# Altium schematic sheet Microcontroller.SchDoc
size A3; SheetNumber: 2; SheetTotal: 8
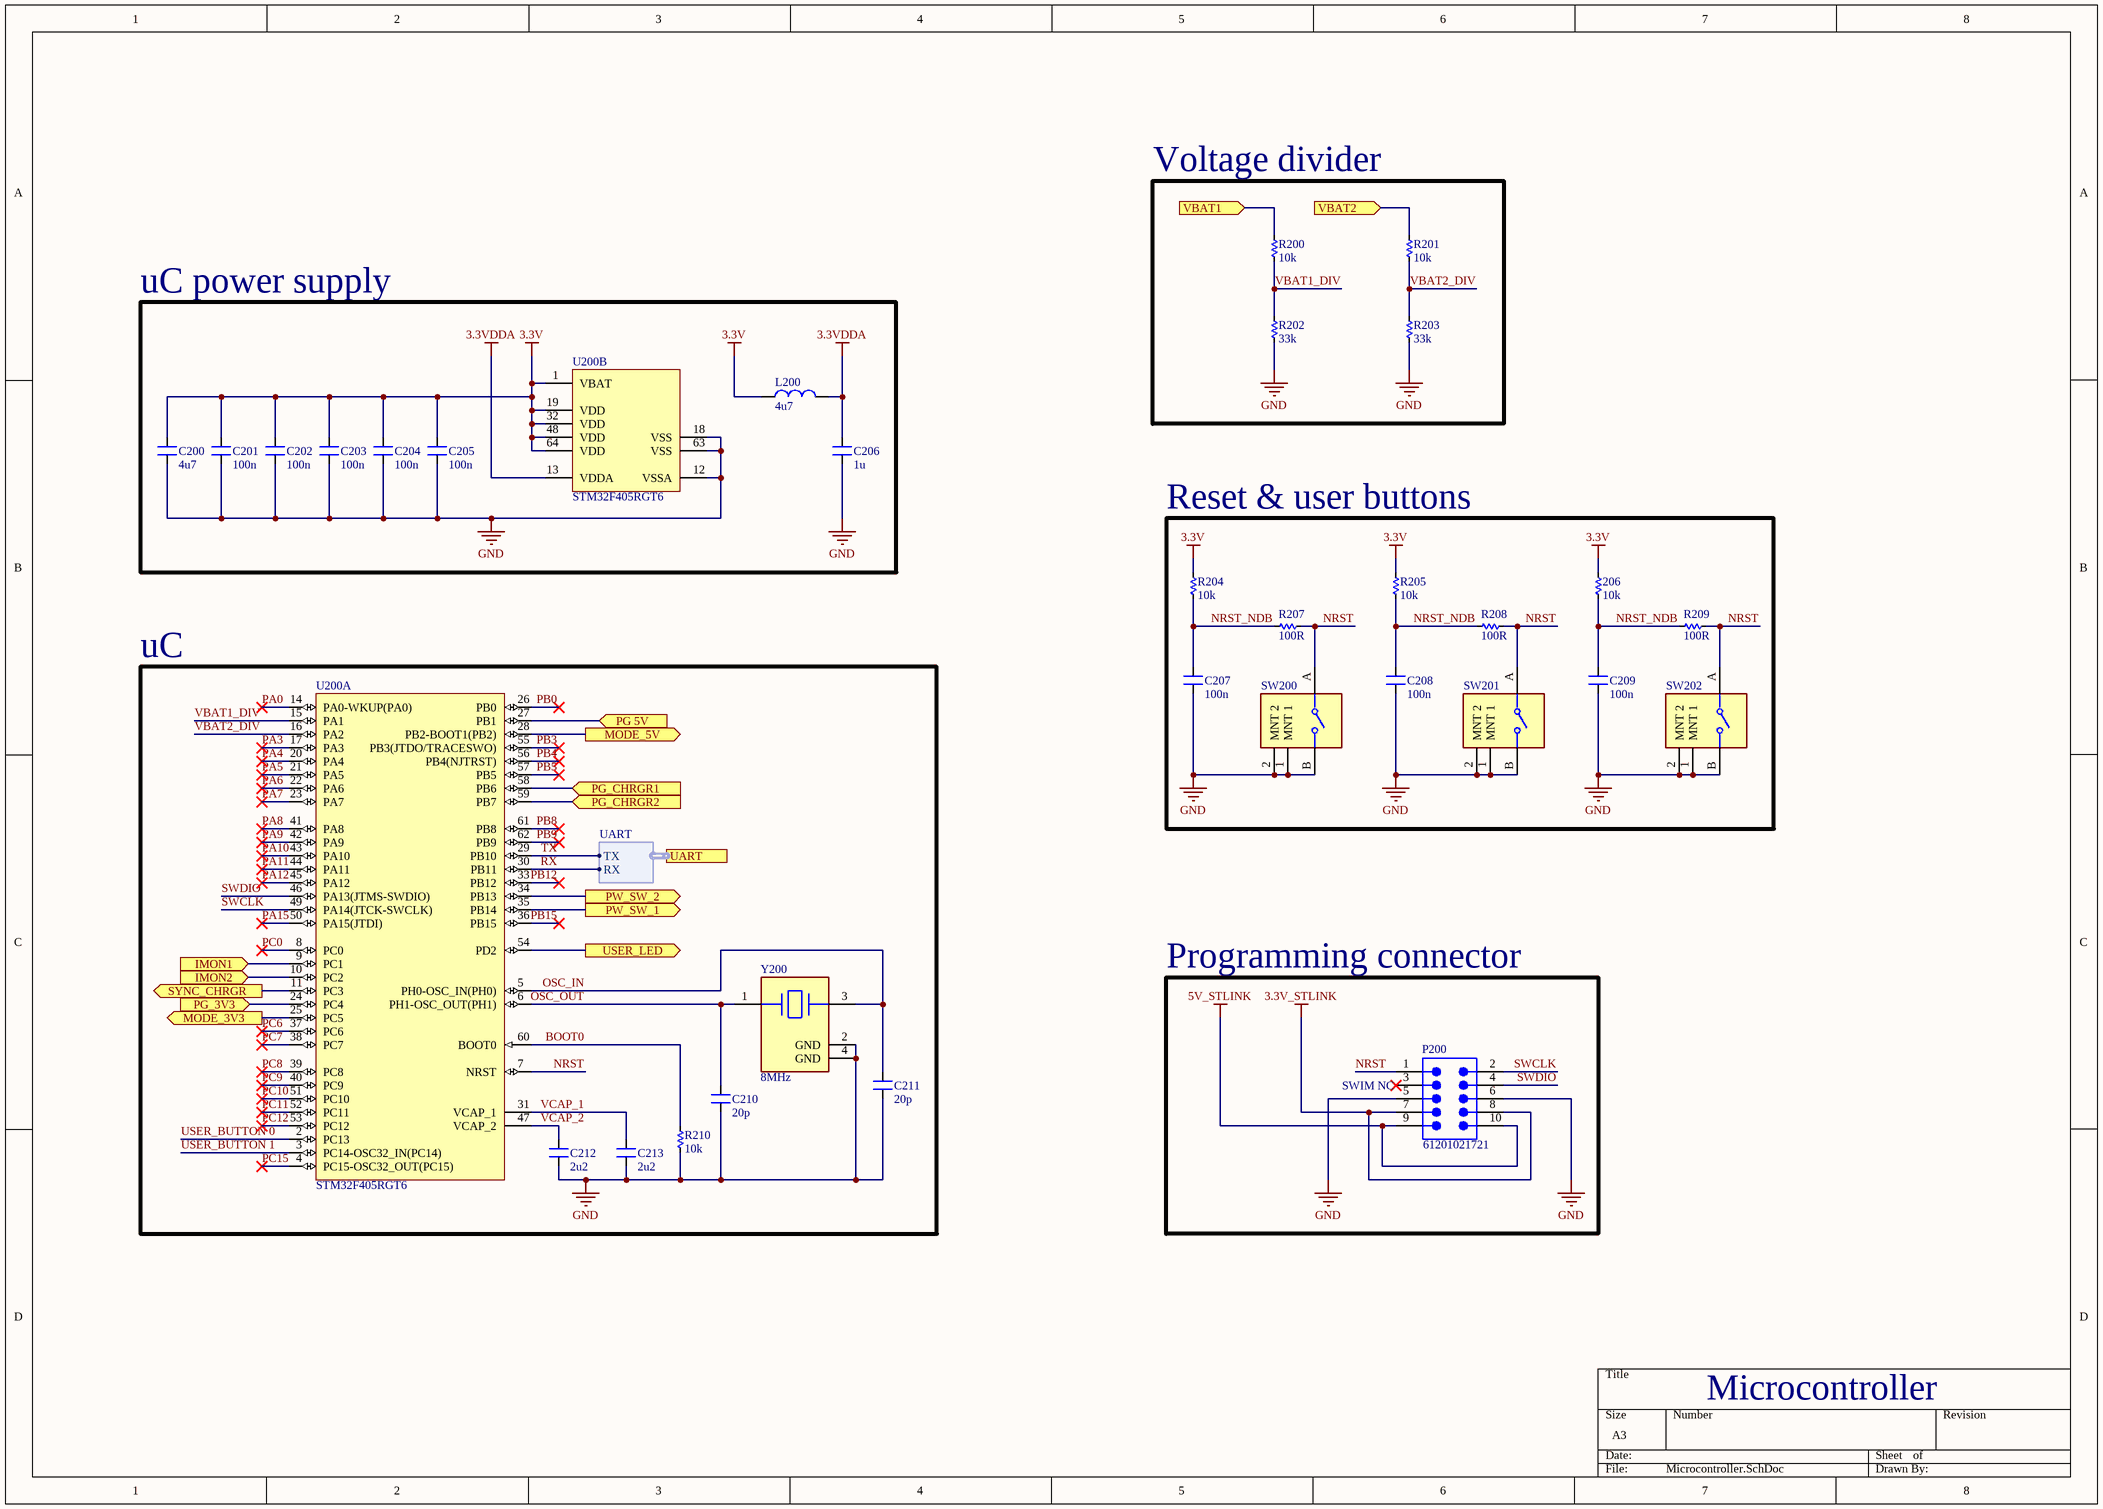
[diagram p0: Microcontroller.SchDoc]

## Parts
206  10k  [RES-SMD-0603]
C200  4u7  [CN-SMD-0603]
C201  100n  [CN-SMD-0603]
C202  100n  [CN-SMD-0603]
C203  100n  [CN-SMD-0603]
C204  100n  [CN-SMD-0603]
C205  100n  [CN-SMD-0603]
C206  1u  [CN-SMD-0603]
C207  100n  [CN-SMD-0603]
C208  100n  [CN-SMD-0603]
C209  100n  [CN-SMD-0603]
C210  20p  [CN-SMD-0603]
C211  20p  [CN-SMD-0603]
C212  2u2  [CN-SMD-0603]
C213  2u2  [CN-SMD-0603]
L200  4u7  [L-SMD-0630]
P200  61201021721  [61201021721]
R200  10k  [RES-SMD-0603]
R201  10k  [RES-SMD-0603]
R202  33k  [RES-SMD-0603]
R203  33k  [RES-SMD-0603]
R204  10k  [RES-SMD-0603]
R205  10k  [RES-SMD-0603]
R207  100R  [RES-SMD-0603]
R208  100R  [RES-SMD-0603]
R209  100R  [RES-SMD-0603]
R210  10k  [RES-SMD-0603]
SW200  EVQ-PF006K  [FP-EVQ-PF006K-MFG]  (value not drawn)
SW201  EVQ-PF006K  [FP-EVQ-PF006K-MFG]  (value not drawn)
SW202  EVQ-PF006K  [FP-EVQ-PF006K-MFG]  (value not drawn)
U200  STM32F405RGT6  [STM-LQFP64_M]  (parts A,B of 2)
Y200  8MHz  [FP-ABM3B-MFG]

## Blocks framed on the sheet
Voltage divider: R200-R203
Reset & user buttons: 206 C207-C209 R204 R205 R207-R209 SW200-SW202
uC: C210-C213 R210 U200 Y200
Programming connector: P200

## Ports
IMON1 (in, see BD[2B]), IMON2 (in, see BD[2B]), MODE_3V3 (out, see BD[2B]), MODE_5V (out, see BD[2B]), PG 5V (in, see BD[2B]), PG_3V3 (in, see BD[2B]), PG_CHRGR1 (in, see BD[2C]), PG_CHRGR2 (in, see BD[2C]), PW_SW_1 (out, see BD[2C], LED connector[2B]), PW_SW_2 (out, see BD[2C], LED connector[2C]), SYNC_CHRGR (out, see BD[2B]), UART (harness UART, see BD[2B], Board-to-board connector[2C]), USER_LED (out, see BD[2C], LED connector[1B]), VBAT1 (in, see BD[2B]), VBAT2 (in, see BD[2B])

## Harnesses
UART: TX, RX

## Nets
3.3V: 206.1 C200.2 C201.2 C202.2 C203.2 C204.2 C205.2 L200.1 R204.1 R205.1 U200.1(VBAT) U200.19(VDD) U200.32(VDD) U200.48(VDD) U200.64(VDD)
3.3V_STLINK: P200.7 P200.8
3.3VDDA: C206.2 L200.2 U200.13(VDDA)
5V_STLINK: P200.9 P200.10
GND: C200.1 C201.1 C202.1 C203.1 C204.1 C205.1 C206.1 C207.1 C208.1 C209.1 C210.1 C211.1 C212.1 C213.1 P200.5 P200.6 R202.2 R203.2 R210.2 SW200.1(MNT_1) SW200.2(MNT_2) SW200.B SW201.1(MNT_1) SW201.2(MNT_2) SW201.B SW202.1(MNT_1) SW202.2(MNT_2) SW202.B U200.12(VSSA) U200.18(VSS) U200.63(VSS) Y200.2(GND) Y200.4(GND)
BOOT0: R210.1 U200.60(BOOT0)
IMON1: U200.9(PC1) ; port IMON1
IMON2: U200.10(PC2) ; port IMON2
MODE_3V3: U200.25(PC5) ; port MODE_3V3
MODE_5V: U200.28(PB2-BOOT1(PB2)) ; port MODE_5V
NRST: P200.1 R207.2 R208.2 R209.2 SW200.A SW201.A SW202.A U200.7(NRST)
NRST_NDB: 206.2 C207.2 C208.2 C209.2 R204.2 R205.2 R207.1 R208.1 R209.1
OSC_IN: C211.2 U200.5(PH0-OSC_IN(PH0)) Y200.3
OSC_OUT: C210.2 U200.6(PH1-OSC_OUT(PH1)) Y200.1
PA0: U200.14(PA0-WKUP(PA0))
PA3: U200.17(PA3)
PA4: U200.20(PA4)
PA5: U200.21(PA5)
PA6: U200.22(PA6)
PA7: U200.23(PA7)
PA8: U200.41(PA8)
PA9: U200.42(PA9)
PA10: U200.43(PA10)
PA11: U200.44(PA11)
PA12: U200.45(PA12)
PA15: U200.50(PA15(JTDI))
PB0: U200.26(PB0)
PB3: U200.55(PB3(JTDO/TRACESWO))
PB4: U200.56(PB4(NJTRST))
PB5: U200.57(PB5)
PB8: U200.61(PB8)
PB9: U200.62(PB9)
PB12: U200.33(PB12)
PB15: U200.36(PB15)
PC0: U200.8(PC0)
PC6: U200.37(PC6)
PC7: U200.38(PC7)
PC8: U200.39(PC8)
PC9: U200.40(PC9)
PC10: U200.51(PC10)
PC11: U200.52(PC11)
PC12: U200.53(PC12)
PC15: U200.4(PC15-OSC32_OUT(PC15))
PG 5V: U200.27(PB1) ; port PG 5V
PG_3V3: U200.24(PC4) ; port PG_3V3
PG_CHRGR1: U200.58(PB6) ; port PG_CHRGR1
PG_CHRGR2: U200.59(PB7) ; port PG_CHRGR2
PW_SW_1: U200.35(PB14) ; port PW_SW_1
PW_SW_2: U200.34(PB13) ; port PW_SW_2
RX: U200.30(PB11) ; port UART.RX
SWCLK: P200.2 U200.49(PA14(JTCK-SWCLK))
SWDIO: P200.4 U200.46(PA13(JTMS-SWDIO))
SYNC_CHRGR: U200.11(PC3) ; port SYNC_CHRGR
TX: U200.29(PB10) ; port UART.TX
USER_BUTTON 0: U200.2(PC13)
USER_BUTTON 1: U200.3(PC14-OSC32_IN(PC14))
USER_LED: U200.54(PD2) ; port USER_LED
VBAT1: R200.1 ; port VBAT1
VBAT1_DIV: R200.2 R202.1 U200.15(PA1)
VBAT2: R201.1 ; port VBAT2
VBAT2_DIV: R201.2 R203.1 U200.16(PA2)
VCAP_1: C213.2 U200.31(VCAP_1)
NetC212_2: C212.2 U200.47(VCAP_2)

Not connected (* = marked no-connect by the designer): P200 3*

## Notes on the sheet
- uC power supply
- (near P200) SWIM NC
- Microcontroller
- Labels drawn without touching a wire or pin: VCAP_2

## Library data of the parts
206 R200-R205 R207-R210 = Res-SMD: Resistor; Manufacturer: Generic Components; Class: Passive; Published: 08/06/2000; Publisher: Altium Hobart Technology Centre
C200-C213 = CN: Value: 33pF
L200 = L-SMD-1: partNo: 78477010; Manufacturer: Wurth Elektronik; Inductance: 1.0 μH; ComponentLink1Description: Manufacturer; ComponentLink1URL: http://www.we-online.de; Created by: Baojun Chen; Created Date: Nov.2015; ComponentLink2Description: Datasheet; ComponentLink2URL: http://katalog.we-online.de/pbs/datasheet/78477010.pdf
P200 = CMP-1502-00021-2: NexarPartId: 8917787; Operating Supply Voltage: 250V; Number of Positions: 10; Contact Resistance: 20mΩ; Connector Type: Male Pin; Current Rating: 3A; Pitch: 2.54mm; Gender: Male; Insulation Resistance: 1GΩ; Insulation: Insulated; Max Operating Temperature: 105°C; Flammability Rating: UL94 V-0; Mount: Through Hole; Contact Material: Copper; Min Operating Temperature: -40°C; Length: 20.36mm; Number of Contacts: 10; Height: 8.85mm; Number of Rows: 2; Housing Material: PBT; Color: Black; Contact Gender: Male; Orientation: Right Angle; Contact Plating: Gold; Number of Pins: 10; Voltage Rating (DC): 250V; RoHS: Compliant; Insulation Material: PBT; REACH SVHC: Unknown; Row Spacing: 2.54mm; Voltage Rating: 250V; Width: 20.36mm; Lead Pitch: 2.54mm; Termination: Through Hole
SW200-SW202 = CMP-00287-39802768-1: EVQ-PF006K Switch Tactile N.O. SPST Round Button PC Pins 0.02A 15VDC 1N Thru-Hole Bulk; Voltage Rating (DC): 15V; Current Rating: 20mA; Actuator Length: 5.85mm; Life (Cycles): 100kcycles; Number of Positions: 2; Switch Function: Off-Mom; Switch Travel: 250µm; Contact Resistance: 50mΩ; Illumination Type: Illuminated, Non-Illuminated; NexarPartId: 39802768; Max Current Rating: 20mA; Color: Black; Height: 7.1mm; Throw Configuration: SPST; Width: 4mm; Packaging: Bulk; Mount: Through Hole; Operating Force: 1N; Lead Free: Lead Free; Contact Current Rating: 20mA; Length: 6.2mm; Max Operating Temperature: 70°C; Min Operating Temperature: -20°C; Contact Plating: Gold, Silver; Orientation: Right Angle; REACH SVHC: No SVHC; Termination: PC Pins; Mechanical Life: 100kcycles; Radiation Hardening: No; Electrical Life: 100kcycles; RoHS: Compliant; Max Voltage Rating (DC): 15V; Depth: 9.85mm
U200 = CMP-0243-00019-3: ARM Cortex-M4 32-bit MCU+FPU, 210 DMIPS, 1024 kB Flash, 192 kB Internal RAM, 51 I/Os, 64-pin LQFP, -40 to 85 degC, Tray; Manufacturer: STMicroelectronics; Supply Voltage(Vcc) min (V): 1.8; Supply Voltage(Vcc) max (V): 3.6; Internal RAM Size (kB): 192; I/Os (High Current): 51; D/A Converter: 2x12-bit; FLASH Size (Prog) (kB): 1024; Operating Frequency(F) (Processor speed) (MHz): 168; ComponentLink2Description: Datasheet; PackageVersion: Rev. 4, 06/2013; DatasheetVersion: Rev. 4; Core: ARM Cortex-M4; ComponentLink2URL: http://www.st.com/st-web-ui/static/active/en/resource/technical/document/datasheet/DM00037051.pdf; PackageReference: LQFP64; Packing: Tray; ComponentLink1Description: Manufacturer URL; ComponentLink3URL: http://www.st.com/st-web-ui/static/active/en/resource/technical/document/datasheet/DM00037051.pdf; ComponentLink3Description: Package Specification; Mounting Technology: Surface Mount; ComponentLink1URL: http://www.st.com/web/en/home.html; PackageDescription: 64-Pin Low Profile Quad Flat Package, 10 x 10 mm Body, 0.5 mm Pitch; PartNumber: STM32F405RGT6
Y200 = CMP-1688-00002-2: Crystal 8MHz ±20ppm 18pF SMD-4 5mm x 3.2mm; ESR (Equivalent Series Resistance): 200R; Frequency Stability: 50ppm; Operating Frequency: 8 MHz; Mount: Surface Mount; Number of Pins: 4; Packaging: Tape and Reel; Width: 0.126inch; Case/Package: CSMD; Lead Free: Lead Free; Depth: 3.2mm; Load Capacitance: 18pF; Min Operating Temperature: -20°C; Series: ABM3B; Package Quantity: 1000; Resistor Type: Ceramic; Height: 0.043inch; Max Operating Temperature: 70°C; Frequency Tolerance: 20ppm; Series Resistance: 200R; Tolerance: 20ppm; Termination: SMD/SMT; Length: 5mm; Frequency: 8MHz